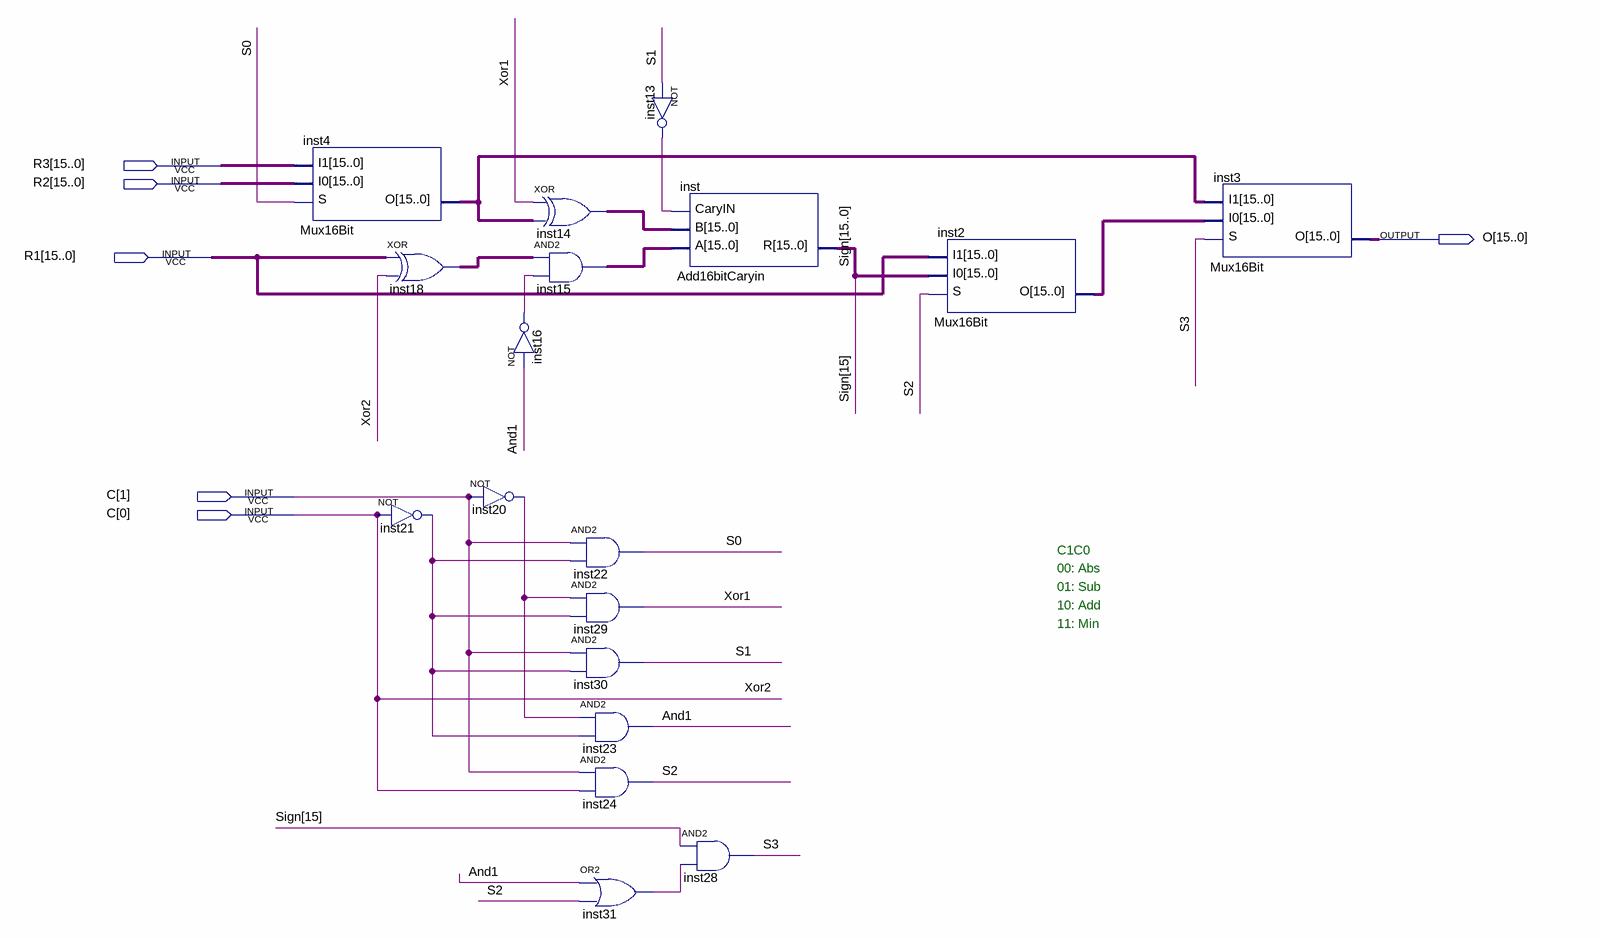
[diagram p0: schematic sheet]
// Quartus schematic MinAbsAddSub.bdf as structural Verilog: 18 symbols, 6 pins
module MinAbsAddSub (
  input  [15:0] R3,
  input  [15:0] R2,
  input  [15:0] R1,
  input  [1:0] C,
  output [15:0] O
);

  wire And1, inst13_out, inst16_out, inst20_out, inst21_out, inst31_out, S0, S1, S2, S3, Xor1;
  wire [15:0] inst2_o, inst4_o, inst14_out, inst15_out, inst18_out, Sign;

  Mux16Bit inst4 (.S(S0), .I0(R2), .I1(R3), .O(inst4_o));
  assign inst18_out = R1 ^ {16{C[0]}};  // XOR inst18, 16 bits wide
  not inst21 (inst21_out, C[0]);
  not inst16 (inst16_out, And1);
  not inst20 (inst20_out, C[1]);
  assign inst14_out = {16{Xor1}} ^ inst4_o;  // XOR inst14, 16 bits wide
  assign inst15_out = inst18_out & {16{inst16_out}};  // AND2 inst15, 16 bits wide
  and inst22 (S0, C[1], inst21_out);
  and inst29 (Xor1, inst20_out, inst21_out);
  and inst30 (S1, C[1], inst21_out);
  and inst23 (And1, inst20_out, inst21_out);
  and inst24 (S2, C[1], C[0]);
  or inst31 (inst31_out, And1, S2);
  not inst13 (inst13_out, S1);
  Add16bitCaryin inst (.A(inst15_out), .B(inst14_out), .CaryIN(inst13_out), .R(Sign));
  and inst28 (S3, Sign[15], inst31_out);
  Mux16Bit inst2 (.S(S2), .I0(Sign), .I1(R1), .O(inst2_o));
  Mux16Bit inst3 (.S(S3), .I0(inst2_o), .I1(inst4_o), .O(O));

  // Other names for the same wires on the sheet: Xor2 = C[0]

  // Notes on the sheet:
  //   C1C0
  //   00: Abs
  //   01: Sub
  //   10: Add
  //   11: Min
endmodule
